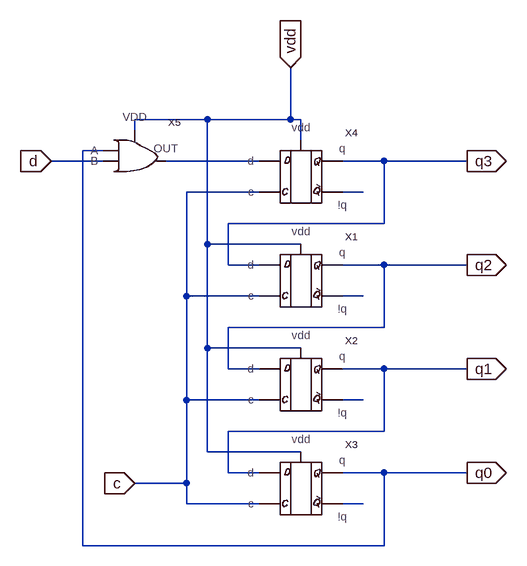
[diagram p0: schematic shift-right.asc]
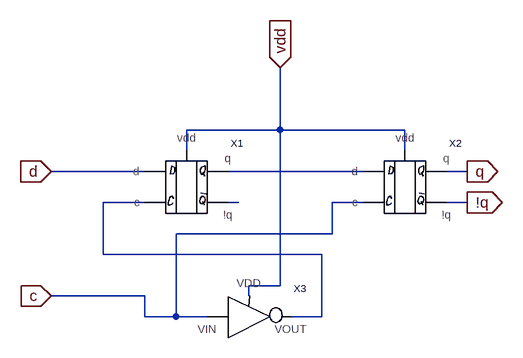
[diagram p1: sub-circuit d-front.asc]
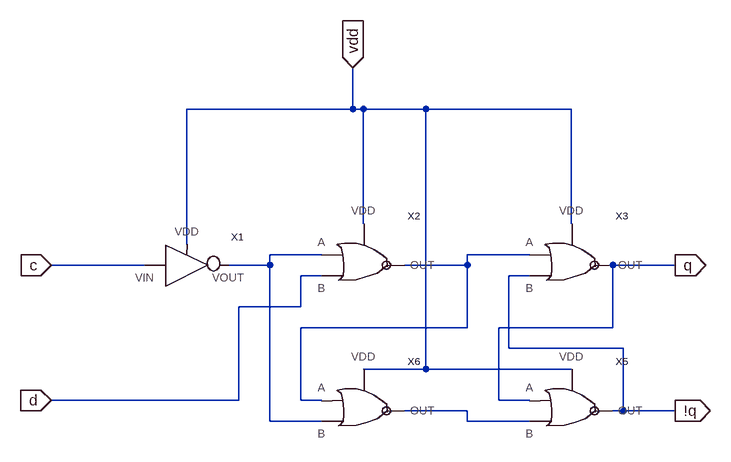
[diagram p2: sub-circuit d-level.asc]
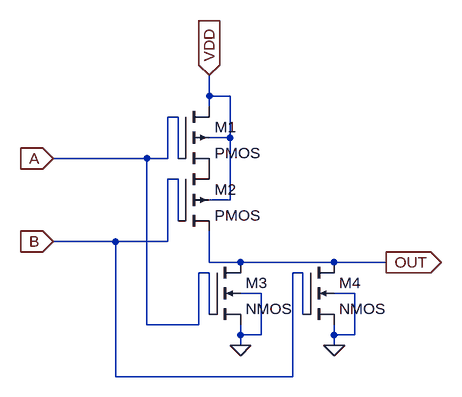
[diagram p3: sub-circuit nor.asc]
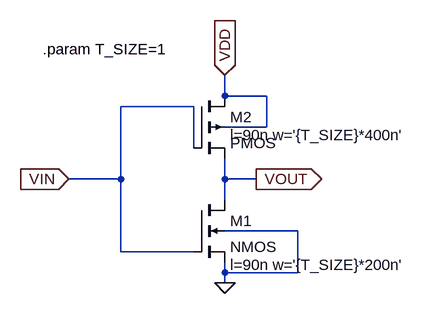
[diagram p4: sub-circuit inverter.asc]
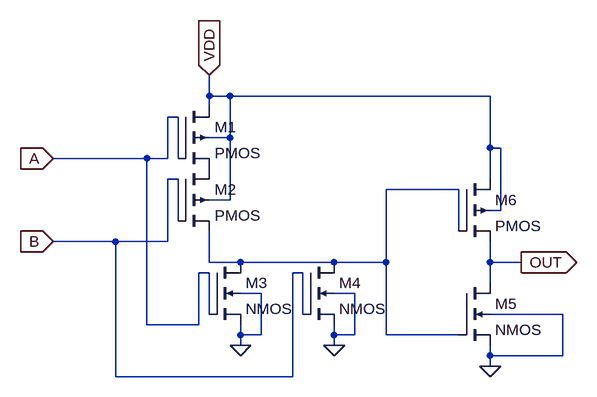
[diagram p5: sub-circuit or.asc]
shift-right.asc, the LTspice schematic file:
Version 4
SHEET 1 2936 680
WIRE 2448 -320 2336 -320
WIRE 2576 -320 2576 -400
WIRE 2576 -320 2448 -320
WIRE 2592 -320 2576 -320
WIRE 2336 -304 2336 -320
WIRE 2592 -288 2592 -320
WIRE 2288 -272 2256 -272
WIRE 2288 -256 2208 -256
WIRE 2528 -256 2384 -256
WIRE 2720 -256 2656 -256
WIRE 2848 -256 2720 -256
WIRE 2528 -208 2416 -208
WIRE 2688 -208 2656 -208
WIRE 2720 -160 2720 -256
WIRE 2720 -160 2480 -160
WIRE 2448 -128 2448 -320
WIRE 2592 -128 2448 -128
WIRE 2480 -96 2480 -160
WIRE 2528 -96 2480 -96
WIRE 2720 -96 2656 -96
WIRE 2848 -96 2720 -96
WIRE 2416 -48 2416 -208
WIRE 2528 -48 2416 -48
WIRE 2688 -48 2656 -48
WIRE 2720 0 2720 -96
WIRE 2720 0 2480 0
WIRE 2448 32 2448 -128
WIRE 2592 32 2448 32
WIRE 2480 64 2480 0
WIRE 2528 64 2480 64
WIRE 2720 64 2656 64
WIRE 2848 64 2720 64
WIRE 2416 112 2416 -48
WIRE 2528 112 2416 112
WIRE 2688 112 2656 112
WIRE 2720 160 2720 64
WIRE 2720 160 2480 160
WIRE 2448 192 2448 32
WIRE 2592 192 2448 192
WIRE 2480 224 2480 160
WIRE 2528 224 2480 224
WIRE 2720 224 2656 224
WIRE 2848 224 2720 224
WIRE 2416 240 2416 112
WIRE 2416 240 2336 240
WIRE 2416 272 2416 240
WIRE 2528 272 2416 272
WIRE 2688 272 2656 272
WIRE 2256 336 2256 -272
WIRE 2720 336 2720 224
WIRE 2720 336 2256 336
FLAG 2336 240 c
IOPIN 2336 240 In
FLAG 2576 -400 vdd
IOPIN 2576 -400 In
FLAG 2208 -256 d
IOPIN 2208 -256 In
FLAG 2848 -256 q3
IOPIN 2848 -256 Out
FLAG 2848 -96 q2
IOPIN 2848 -96 Out
FLAG 2848 64 q1
IOPIN 2848 64 Out
FLAG 2848 224 q0
IOPIN 2848 224 Out
SYMBOL d-front 2592 -64 R0
SYMATTR InstName X1
SYMBOL d-front 2592 96 R0
SYMATTR InstName X2
SYMBOL d-front 2592 256 R0
SYMATTR InstName X3
SYMBOL d-front 2592 -224 R0
SYMATTR InstName X4
SYMBOL or 2352 -256 R0
SYMATTR InstName X5

d-front.asc, the sub-circuit schematic file:
Version 4
SHEET 1 880 680
WIRE 240 64 240 -32
WIRE 240 64 96 64
WIRE 432 64 240 64
WIRE 96 96 96 64
WIRE 432 96 432 64
WIRE 32 128 -112 128
WIRE 368 128 160 128
WIRE 528 128 496 128
WIRE 32 176 -32 176
WIRE 176 176 160 176
WIRE 368 176 320 176
WIRE 528 176 496 176
WIRE 320 224 320 176
WIRE 320 224 80 224
WIRE -32 256 -32 176
WIRE 304 256 -32 256
WIRE 240 304 240 64
WIRE 240 304 192 304
WIRE 32 320 -112 320
WIRE 192 320 192 304
WIRE 32 352 32 320
WIRE 80 352 80 224
WIRE 80 352 32 352
WIRE 128 352 80 352
WIRE 304 352 304 256
WIRE 304 352 256 352
FLAG -112 128 d
IOPIN -112 128 In
FLAG -112 320 c
IOPIN -112 320 In
FLAG 528 128 q
IOPIN 528 128 Out
FLAG 528 176 !q
IOPIN 528 176 Out
FLAG 240 -32 vdd
IOPIN 240 -32 In
SYMBOL d-level 96 160 R0
SYMATTR InstName X1
SYMBOL d-level 432 160 R0
SYMATTR InstName X2
SYMBOL inverter 192 352 R0
SYMATTR InstName X3

d-level.asc, the sub-circuit schematic file:
Version 4
SHEET 1 928 680
WIRE 352 -112 352 -176
WIRE 352 -112 96 -112
WIRE 368 -112 352 -112
WIRE 464 -112 368 -112
WIRE 688 -112 464 -112
WIRE 368 64 368 -112
WIRE 688 64 688 -112
WIRE 96 96 96 -112
WIRE 304 112 224 112
WIRE 624 112 528 112
WIRE 32 128 -112 128
WIRE 224 128 224 112
WIRE 224 128 160 128
WIRE 528 128 528 112
WIRE 528 128 432 128
WIRE 848 128 752 128
WIRE 304 144 272 144
WIRE 624 144 592 144
WIRE 272 192 272 144
WIRE 272 192 176 192
WIRE 528 224 528 128
WIRE 528 224 272 224
WIRE 752 224 752 128
WIRE 752 224 576 224
WIRE 592 256 592 144
WIRE 768 256 592 256
WIRE 464 288 464 -112
WIRE 464 288 368 288
WIRE 688 288 464 288
WIRE 176 336 176 192
WIRE 176 336 -112 336
WIRE 272 336 272 224
WIRE 304 336 272 336
WIRE 576 336 576 224
WIRE 624 336 576 336
WIRE 528 352 432 352
WIRE 768 352 768 256
WIRE 768 352 752 352
WIRE 848 352 768 352
WIRE 224 368 224 128
WIRE 304 368 224 368
WIRE 528 368 528 352
WIRE 624 368 528 368
FLAG -112 336 d
IOPIN -112 336 In
FLAG -112 128 c
IOPIN -112 128 In
FLAG 848 128 q
IOPIN 848 128 Out
FLAG 848 352 !q
IOPIN 848 352 Out
FLAG 352 -176 vdd
IOPIN 352 -176 In
SYMBOL nor 368 128 R0
SYMATTR InstName X2
SYMBOL nor 688 128 R0
SYMATTR InstName X3
SYMBOL nor 688 352 R0
SYMATTR InstName X5
SYMBOL nor 368 352 R0
SYMATTR InstName X6
SYMBOL inverter 96 128 R0
SYMATTR InstName X1

nor.asc, the sub-circuit schematic file:
Version 4
SHEET 1 880 680
WIRE 352 0 352 -32
WIRE 384 0 352 0
WIRE 352 16 352 0
WIRE 304 32 288 32
WIRE 384 64 384 0
WIRE 384 64 352 64
WIRE 256 96 112 96
WIRE 288 96 288 32
WIRE 288 96 256 96
WIRE 304 96 304 32
WIRE 304 128 288 128
WIRE 384 160 384 64
WIRE 384 160 352 160
WIRE 304 192 304 128
WIRE 208 224 112 224
WIRE 288 224 288 128
WIRE 288 224 208 224
WIRE 352 256 352 208
WIRE 400 256 352 256
WIRE 544 256 400 256
WIRE 624 256 544 256
WIRE 352 272 336 272
WIRE 496 272 480 272
WIRE 432 304 400 304
WIRE 576 304 544 304
WIRE 352 336 352 272
WIRE 496 336 496 272
WIRE 256 352 256 96
WIRE 336 352 336 272
WIRE 336 352 256 352
WIRE 400 368 400 352
WIRE 432 368 432 304
WIRE 432 368 400 368
WIRE 544 368 544 352
WIRE 576 368 576 304
WIRE 576 368 544 368
WIRE 400 384 400 368
WIRE 544 384 544 368
WIRE 208 432 208 224
WIRE 480 432 480 272
WIRE 480 432 208 432
FLAG 352 -32 VDD
IOPIN 352 -32 In
FLAG 400 384 0
FLAG 544 384 0
FLAG 624 256 OUT
IOPIN 624 256 Out
FLAG 112 96 A
IOPIN 112 96 In
FLAG 112 224 B
IOPIN 112 224 In
SYMBOL pmos4 304 16 R0
SYMATTR InstName M1
SYMATTR Value2 l=90n w=400n
SYMBOL pmos4 304 112 R0
SYMATTR InstName M2
SYMATTR Value2 l=90n w=400n
SYMBOL nmos4 352 256 R0
SYMATTR InstName M3
SYMATTR Value2 l=90n w=200n
SYMBOL nmos4 496 256 R0
SYMATTR InstName M4
SYMATTR Value2 l=90n w=200n

inverter.asc, the sub-circuit schematic file:
Version 4
SHEET 1 880 680
WIRE 176 -128 176 -160
WIRE 240 -128 176 -128
WIRE 128 -112 16 -112
WIRE 240 -80 240 -128
WIRE 240 -80 176 -80
WIRE 128 -48 128 -112
WIRE 16 0 16 -112
WIRE 16 0 -64 0
WIRE 176 0 176 -32
WIRE 224 0 176 0
WIRE 176 32 176 0
WIRE 288 80 176 80
WIRE 16 112 16 0
WIRE 128 112 16 112
WIRE 176 144 176 128
WIRE 288 144 288 80
WIRE 288 144 176 144
WIRE 176 160 176 144
FLAG 176 160 0
FLAG -64 0 VIN
IOPIN -64 0 In
FLAG 224 0 VOUT
IOPIN 224 0 Out
FLAG 176 -160 VDD
IOPIN 176 -160 In
SYMBOL nmos4 128 32 R0
WINDOW 123 56 100 Left 2
SYMATTR InstName M1
SYMATTR Value2 l=90n w='{T_SIZE}*200n'
SYMBOL pmos4 128 -128 R0
WINDOW 123 56 60 Left 2
SYMATTR InstName M2
SYMATTR Value2 l=90n w='{T_SIZE}*400n'
TEXT -104 -200 Left 2 !.param T_SIZE=1

or.asc, the sub-circuit schematic file:
Version 4
SHEET 1 1084 680
WIRE 32 -32 32 -64
WIRE 64 -32 32 -32
WIRE 464 -32 64 -32
WIRE 32 -16 32 -32
WIRE -16 0 -32 0
WIRE 64 32 64 -32
WIRE 64 32 32 32
WIRE 464 48 464 -32
WIRE 480 48 464 48
WIRE -64 64 -208 64
WIRE -32 64 -32 0
WIRE -32 64 -64 64
WIRE -16 64 -16 0
WIRE -16 96 -32 96
WIRE 464 96 464 48
WIRE 416 112 304 112
WIRE 64 128 64 32
WIRE 64 128 32 128
WIRE 480 144 480 48
WIRE 480 144 464 144
WIRE -16 160 -16 96
WIRE 416 176 416 112
WIRE -112 192 -208 192
WIRE -32 192 -32 96
WIRE -32 192 -112 192
WIRE 32 224 32 176
WIRE 80 224 32 224
WIRE 224 224 80 224
WIRE 304 224 304 112
WIRE 304 224 224 224
WIRE 464 224 464 192
WIRE 512 224 464 224
WIRE 32 240 16 240
WIRE 176 240 160 240
WIRE 464 256 464 224
WIRE 112 272 80 272
WIRE 256 272 224 272
WIRE 32 304 32 240
WIRE 176 304 176 240
WIRE 576 304 464 304
WIRE -64 320 -64 64
WIRE 16 320 16 240
WIRE 16 320 -64 320
WIRE 80 336 80 320
WIRE 112 336 112 272
WIRE 112 336 80 336
WIRE 224 336 224 320
WIRE 256 336 256 272
WIRE 256 336 224 336
WIRE 304 336 304 224
WIRE 416 336 304 336
WIRE 80 352 80 336
WIRE 224 352 224 336
WIRE 464 368 464 352
WIRE 576 368 576 304
WIRE 576 368 464 368
WIRE 464 384 464 368
WIRE -112 400 -112 192
WIRE 160 400 160 240
WIRE 160 400 -112 400
FLAG 32 -64 VDD
IOPIN 32 -64 In
FLAG 80 352 0
FLAG 224 352 0
FLAG -208 64 A
IOPIN -208 64 In
FLAG -208 192 B
IOPIN -208 192 In
FLAG 464 384 0
FLAG 512 224 OUT
IOPIN 512 224 Out
SYMBOL pmos4 -16 -16 R0
SYMATTR InstName M1
SYMATTR Value2 l=90n w=400n
SYMBOL pmos4 -16 80 R0
SYMATTR InstName M2
SYMATTR Value2 l=90n w=400n
SYMBOL nmos4 32 224 R0
SYMATTR InstName M3
SYMATTR Value2 l=90n w=200n
SYMBOL nmos4 176 224 R0
SYMATTR InstName M4
SYMATTR Value2 l=90n w=200n
SYMBOL nmos4 416 256 R0
SYMATTR Value2 l=90n w=200n
SYMATTR InstName M5
SYMBOL pmos4 416 96 R0
SYMATTR Value2 l=90n w=400n
SYMATTR InstName M6

The netlist it stands for:
* shift-right.asc
XX1 q3 c vdd q2 N003 d-front
XX2 q2 c vdd q1 N004 d-front
XX3 q1 c vdd q0 N005 d-front
XX4 N001 c vdd q3 N002 d-front
XX5 q0 d vdd N001 or

* block symbol definitions
.subckt d-front d c vdd q !q
XX1 d N002 N001 N003 vdd d-level
XX2 N001 c q !q vdd d-level
XX3 c vdd N002 inverter
.ends d-front

.subckt d-level d c q !q vdd
XX2 N001 d N002 vdd nor
XX3 N002 !q q vdd nor
XX5 q N003 !q vdd nor
XX6 N002 N001 N003 vdd nor
XX1 c vdd N001 inverter
.ends d-level

.subckt nor A B OUT VDD
M1 VDD A P001 VDD PMOS l=90n w=400n
M2 P001 B OUT VDD PMOS l=90n w=400n
M3 OUT A 0 0 NMOS l=90n w=200n
M4 OUT B 0 0 NMOS l=90n w=200n
.ends nor

.subckt inverter VIN VDD VOUT
M1 VOUT VIN 0 0 NMOS l=90n w='{T_SIZE}*200n'
M2 VDD VIN VOUT VDD PMOS l=90n w='{T_SIZE}*400n'
.param T_SIZE=1
.ends inverter

.subckt or A B VDD OUT
M1 VDD A P001 VDD PMOS l=90n w=400n
M2 P001 B N001 VDD PMOS l=90n w=400n
M3 N001 A 0 0 NMOS l=90n w=200n
M4 N001 B 0 0 NMOS l=90n w=200n
M5 OUT N001 0 0 NMOS l=90n w=200n
M6 VDD N001 OUT VDD PMOS l=90n w=400n
.ends or

.model NMOS NMOS
.model PMOS PMOS
.lib standard.mos
.backanno
.end